# Altium schematic sheet lm27313_5_12.SchDoc
size A4
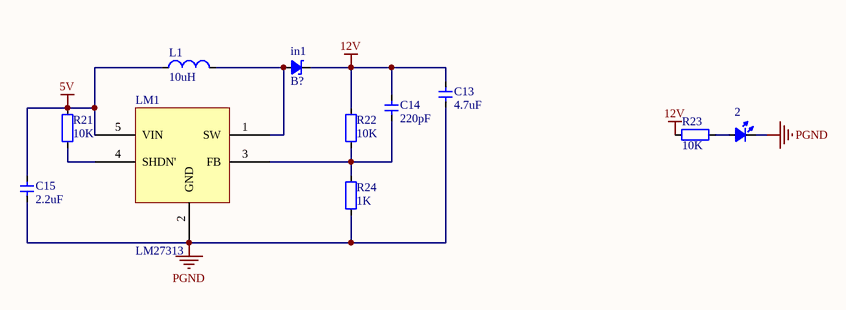
[diagram p0: lm27313_5_12.SchDoc]

## Parts
2  LED_0805  [LED_0805_GREEN]  (value not drawn)
C13  value 4.7uF  [CAP_0603]  (hidden comment: Cap_0603)
C14  value 220pF  [CAP_0603]  (hidden comment: Cap_0603)
C15  value 2.2uF  [CAP_0603]  (hidden comment: Cap_0603)
in1  value B?  [SOD-123]  (hidden comment: SchottkyDiode_SOD123)
L1  value 10uH  [indmm5x2_2_2]
LM1  LM27313  [SOT23-5]
R21  value 10K  [RES_0603]  (hidden comment: Res_0603)
R22  value 10K  [RES_0603]  (hidden comment: Res_0603)
R23  value 10K  [RES_0603]  (hidden comment: Res_0603)
R24  value 1K  [RES_0603]  (hidden comment: Res_0603)

## Nets
5V: C15.2 L1.1 LM1.5(VIN) R21.2
12V: C13.2 C14.2 in1.2(K) R22.2 R23.1
PGND: 2.2(K) C13.1 C15.1 LM1.2(GND) R24.1
Net2_1: 2.1(A) R23.2
NetC14_1: C14.1 LM1.3(FB) R22.1 R24.2
Netin1_1: in1.1(A) L1.2 LM1.1(SW)
NetLM1_4: LM1.4(SHDN') R21.1

## Library data of the parts
2 = LED_0603: LED
C13-C15 = Cap_0603: Capacitor
in1 = SchottkyDiode_SOD123: Diode
L1 = Ind_0603: Inductor
R21-R24 = Res_0603: Resistor